# EAGLE design SRAM 4MB 2048kbx16 CPLD_Proto (EAGLE 6.4)
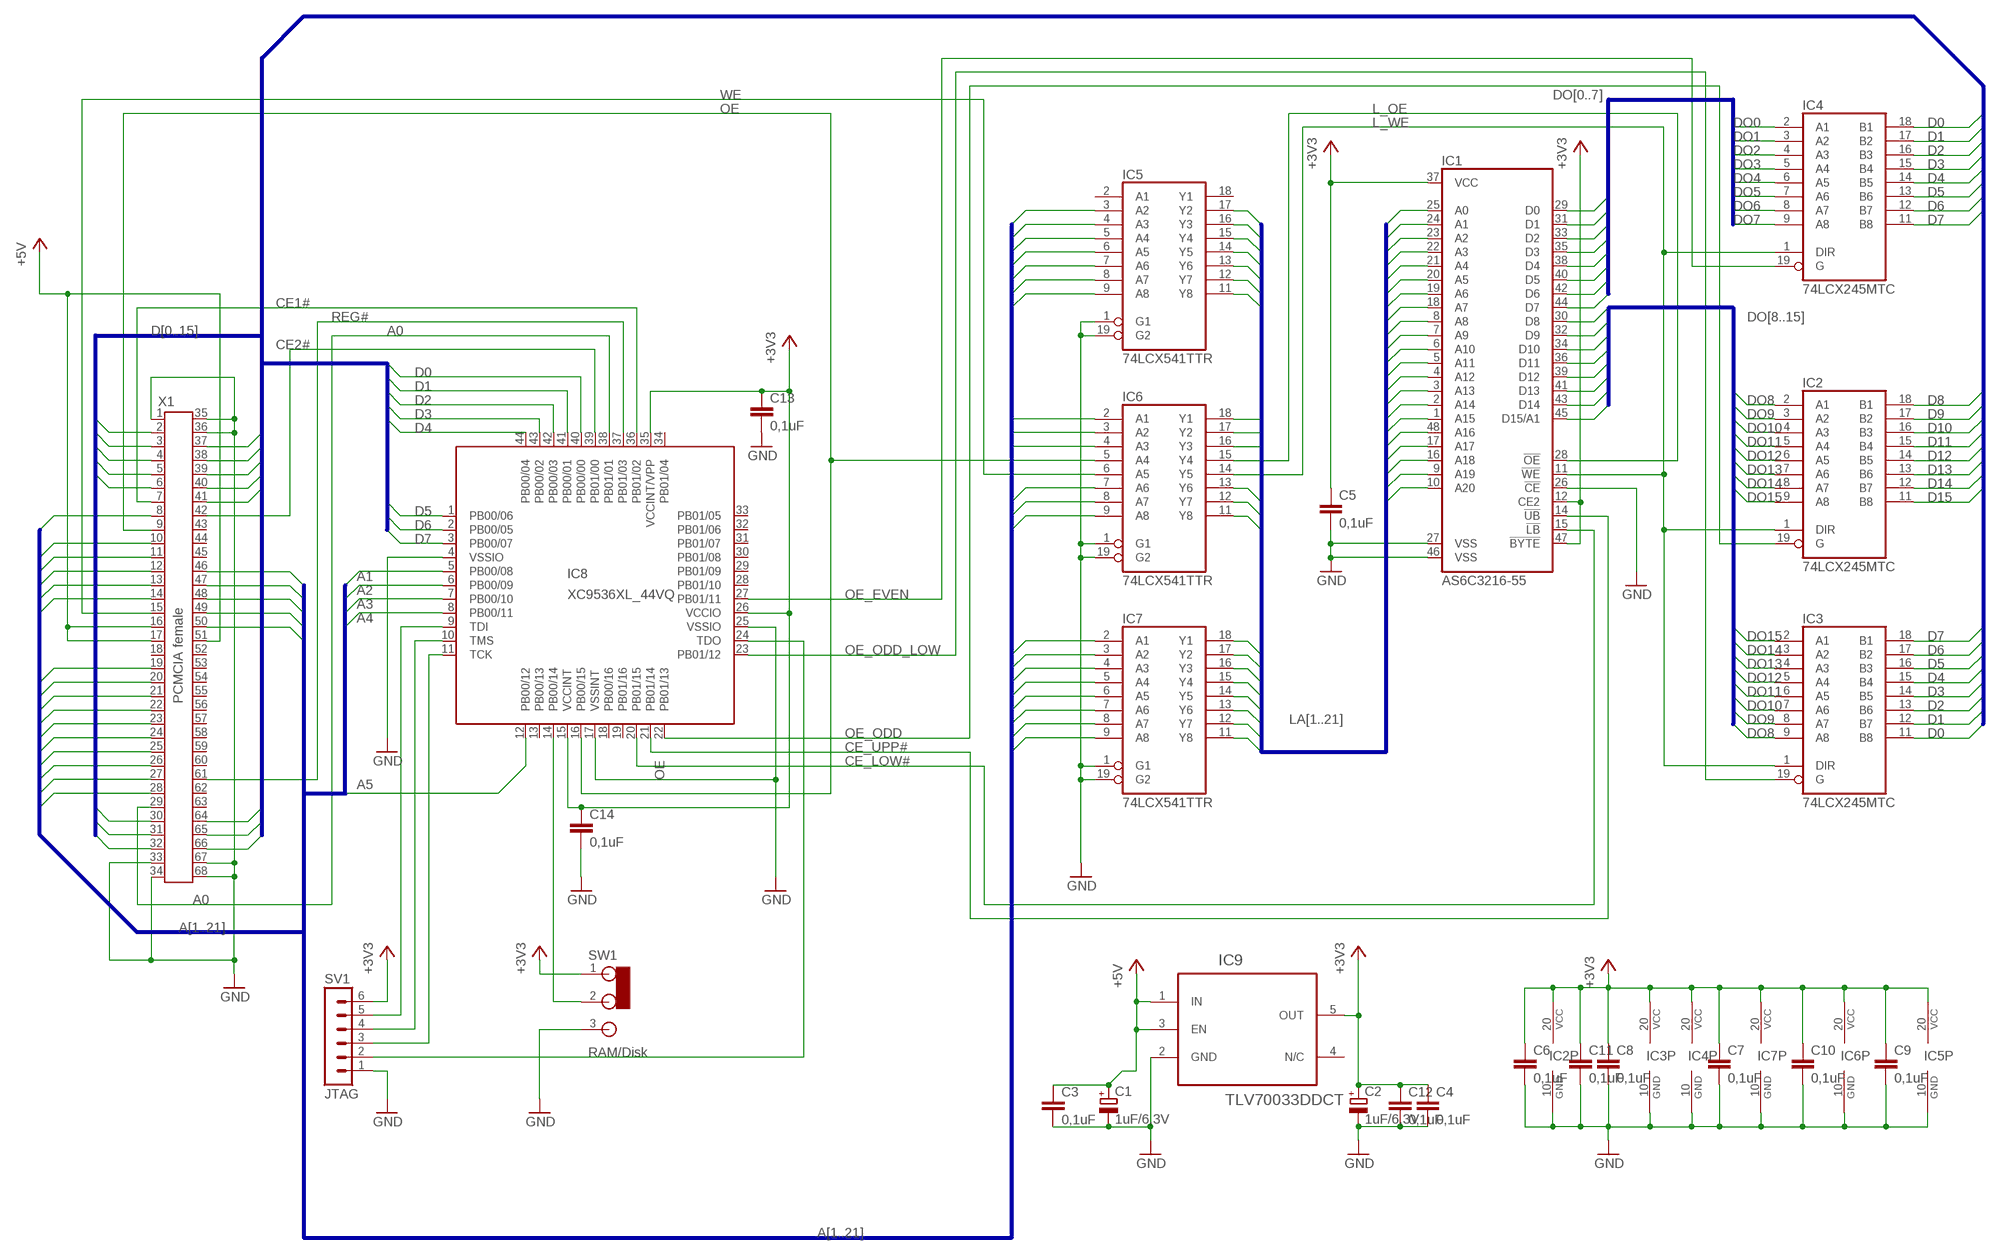
[diagram p0: schematic, sheet 1]

## Parts
C1  1uF/6,3V  CPOL-EUA/3216-18R  [A/3216-18R]
C2  1uF/6,3V  CPOL-EUA/3216-18R  [A/3216-18R]
C3  0,1uF  C-EUC0603  [C0603]
C4  0,1uF  C-EUC0603  [C0603]
C5  0,1uF  C-EUC0402K  [C0402K]
C6  0,1uF  C-EUC0402K  [C0402K]
C7  0,1uF  C-EUC0402K  [C0402K]
C8  0,1uF  C-EUC0402K  [C0402K]
C9  0,1uF  C-EUC0402K  [C0402K]
C10  0,1uF  C-EUC0402K  [C0402K]
C11  0,1uF  C-EUC0402K  [C0402K]
C12  0,1uF  C-EUC0402K  [C0402K]
C13  0,1uF  C-EUC0402K  [C0402K]
C14  0,1uF  C-EUC0402K  [C0402K]
IC1  AS6C3216-55  [TSOP-48]
IC2  74LCX245MTC  74LS245MTC  [TSSOP20]
IC3  74LCX245MTC  74LS245MTC  [TSSOP20]
IC4  74LCX245MTC  74LS245MTC  [TSSOP20]
IC5  74LCX541TTR  74541TTR  [TSSOP20]
IC6  74LCX541TTR  74541TTR  [TSSOP20]
IC7  74LCX541TTR  74541TTR  [TSSOP20]
IC8  XC9536XL_44VQ  XC9536_44VQ  [SQFP-S-10X10-44]
IC9  TLV70033DDCT  [SOT95P280X110-5N]
SV1  JTAG  MA06-1  [MA06-1]
SW1  RAM/Disk  AYZ0102AGRLC  [SWITCH2]
X1  PCMCIA female  9M681X03TB9M681Z04  [9M681X04]

## Nets
+3V3 [+3.3V]: C2.+ C4.1 C5.1 C6.1 C7.1 C8.1 C9.1 C10.1 C11.1 C12.1 C13.1 C14.1 IC1.12(CE2) IC1.37(VCC) IC1.47(!BYTE) IC2.20(VCC) IC3.20(VCC) IC4.20(VCC) IC5.20(VCC) IC6.20(VCC) IC7.20(VCC) IC8.15(VCCINT) IC8.26(VCCIO) IC8.35(VCCINT/VPP) IC9.5(OUT) SV1.6 SW1.1
+5V [+5V]: C1.+ C3.1 IC9.1(IN) IC9.3(EN) X1.16 X1.17 X1.51
A0: IC8.38(PB01/01) X1.29
A1: IC6.4(A3) IC8.5(PB00/08) X1.28
A2: IC5.3(A2) IC8.6(PB00/09) X1.27
A3: IC5.4(A3) IC8.7(PB00/10) X1.26
A4: IC5.5(A4) IC8.8(PB00/11) X1.25
A5: IC5.6(A5) IC8.12(PB00/12) X1.24
A6: IC5.7(A6) X1.23
A7: IC5.8(A7) X1.22
A8: IC5.9(A8) X1.12
A9: IC6.9(A8) X1.11
A10: IC7.9(A8) X1.8
A11: IC7.8(A7) X1.10
A12: IC7.7(A6) X1.21
A13: IC7.6(A5) X1.13
A14: IC7.5(A4) X1.14
A15: IC7.4(A3) X1.20
A16: IC7.3(A2) X1.19
A17: IC7.2(A1) X1.46
A18: IC6.2(A1) X1.47
A19: IC6.3(A2) X1.48
A20: IC6.8(A7) X1.49
A21: IC6.7(A6) X1.50
CE1#: IC8.36(PB01/02) X1.7
CE2#: IC8.39(PB01/00) X1.42
CE_LOW#: IC1.15(!LB) IC8.20(PB01/15)
CE_UPP#: IC1.14(!UB) IC8.21(PB01/14)
D0: IC3.11(B8) IC4.18(B1) IC8.40(PB00/00) X1.30
D1: IC3.12(B7) IC4.17(B2) IC8.41(PB00/01) X1.31
D2: IC3.13(B6) IC4.16(B3) IC8.42(PB00/03) X1.32
D3: IC3.14(B5) IC4.15(B4) IC8.43(PB00/02) X1.2
D4: IC3.15(B4) IC4.14(B5) IC8.44(PB00/04) X1.3
D5: IC3.16(B3) IC4.13(B6) IC8.1(PB00/06) X1.4
D6: IC3.17(B2) IC4.12(B7) IC8.2(PB00/05) X1.5
D7: IC3.18(B1) IC4.11(B8) IC8.3(PB00/07) X1.6
D8: IC2.18(B1) X1.64
D9: IC2.17(B2) X1.65
D10: IC2.16(B3) X1.66
D11: IC2.15(B4) X1.37
D12: IC2.14(B5) X1.38
D13: IC2.13(B6) X1.39
D14: IC2.12(B7) X1.40
D15: IC2.11(B8) X1.41
DO0: IC1.29(D0) IC4.2(A1)
DO1: IC1.31(D1) IC4.3(A2)
DO2: IC1.33(D2) IC4.4(A3)
DO3: IC1.35(D3) IC4.5(A4)
DO4: IC1.38(D4) IC4.6(A5)
DO5: IC1.40(D5) IC4.7(A6)
DO6: IC1.42(D6) IC4.8(A7)
DO7: IC1.44(D7) IC4.9(A8)
DO8: IC1.30(D8) IC2.2(A1) IC3.9(A8)
DO9: IC1.32(D9) IC2.3(A2) IC3.8(A7)
DO10: IC1.34(D10) IC2.4(A3) IC3.7(A6)
DO11: IC1.36(D11) IC2.5(A4) IC3.6(A5)
DO12: IC1.39(D12) IC2.6(A5) IC3.5(A4)
DO13: IC1.41(D13) IC2.7(A6) IC3.4(A3)
DO14: IC1.43(D14) IC2.8(A7) IC3.3(A2)
DO15: IC1.45(D15/A1) IC2.9(A8) IC3.2(A1)
GND [Ground]: C1.- C2.- C3.2 C4.2 C5.2 C6.2 C7.2 C8.2 C9.2 C10.2 C11.2 C12.2 C13.2 C14.2 IC1.26(!CE) IC1.27(VSS) IC1.46(VSS) IC2.10(GND) IC3.10(GND) IC4.10(GND) IC5.1(G1) IC5.10(GND) IC5.19(G2) IC6.1(G1) IC6.10(GND) IC6.19(G2) IC7.1(G1) IC7.10(GND) IC7.19(G2) IC8.4(VSSIO) IC8.17(VSSINT) IC8.25(VSSIO) IC9.2(GND) SV1.1 SW1.3 X1.1 X1.33 X1.34 X1.35 X1.36 X1.67 X1.68
L_OE: IC1.28(!OE) IC6.15(Y4)
L_WE: IC1.11(!WE) IC2.1(DIR) IC3.1(DIR) IC4.1(DIR) IC6.14(Y5)
LA1: IC1.25(A0) IC6.16(Y3)
LA2: IC1.24(A1) IC5.17(Y2)
LA3: IC1.23(A2) IC5.16(Y3)
LA4: IC1.22(A3) IC5.15(Y4)
LA5: IC1.21(A4) IC5.14(Y5)
LA6: IC1.20(A5) IC5.13(Y6)
LA7: IC1.19(A6) IC5.12(Y7)
LA8: IC1.18(A7) IC5.11(Y8)
LA9: IC1.8(A8) IC6.11(Y8)
LA10: IC1.7(A9) IC7.11(Y8)
LA11: IC1.6(A10) IC7.12(Y7)
LA12: IC1.5(A11) IC7.13(Y6)
LA13: IC1.4(A12) IC7.14(Y5)
LA14: IC1.3(A13) IC7.15(Y4)
LA15: IC1.2(A14) IC7.16(Y3)
LA16: IC1.1(A15) IC7.17(Y2)
LA17: IC1.48(A16) IC7.18(Y1)
LA18: IC1.17(A17) IC6.18(Y1)
LA19: IC1.16(A18) IC6.17(Y2)
LA20: IC1.9(A19) IC6.12(Y7)
LA21: IC1.10(A20) IC6.13(Y6)
N$1: IC8.24(TDO) SV1.2
N$2: IC8.11(TCK) SV1.3
N$3: IC8.10(TMS) SV1.4
N$4: IC8.9(TDI) SV1.5
N$8: IC8.14(PB00/14) SW1.2
OE: IC6.5(A4) IC8.16(PB00/15) X1.9
OE_EVEN: IC4.19(G) IC8.27(PB01/11)
OE_ODD: IC2.19(G) IC8.22(PB01/13)
OE_ODD_LOW: IC3.19(G) IC8.23(PB01/12)
REG#: IC8.37(PB01/03) X1.61
WE: IC6.6(A5) X1.15
Unconnected: IC5.2(A1) IC5.18(Y1) IC8.13(PB00/13) IC8.18(PB00/16) IC8.19(PB01/16) IC8.28(PB01/10) IC8.29(PB01/09) IC8.30(PB01/08) IC8.31(PB01/07) IC8.32(PB01/06) IC8.33(PB01/05) IC8.34(PB01/04) IC9.4(N/C) X1.18 X1.43 X1.44 X1.45 X1.52 X1.53 X1.54 X1.55 X1.56 X1.57 X1.58 X1.59 X1.60 X1.62 X1.63

## Buses
DO[8..15]
DO[0..7]
D[0..15]
A[1..21]
LA[1..21]

## Library data of the parts
C1 C2 = resistor:CPOL-EU: POLARIZED CAPACITOR, European symbol
C3-C14 = resistor:C-EU: CAPACITOR, European symbol
IC1 = Alliance_Memory_By_element14_Batch_1:AS6C3216-55: SRAM memory 32Mb (2MB x 16 lub 4MB x 8)
IC2-IC4 = 74xx-us:74*245: Octal BUS TRANSCEIVER, 3-state
IC5-IC7 = 74xx-us:74*541: Octal BUFFER and LINE DRIVER, 3-state
IC8 = xilinx-xc9:XC9536_44VQ: xc9536_pc44 XC9500 In-System Programmable CPLD Family Auto generated by make-symbol-device-package-bsdl.ulp Rev. 34 Source: xc9536_vq44.bsd; MPN: XC9536-15VQG44C; OC_FARNELL: 1193227; OC_NEWARK: 98K3377
IC9 = _V-reg33V:TLV70033DDCT: 200-mA, Low-IQ, Low-Dropout Regulator for Portable Devices; MPN: TLV70033DDCT; OC_FARNELL: 1778230; OC_NEWARK: 50R4446; PACKAGE: TSOT-23-5; SUPPLIER: Texas Instruments
SV1 = con-lstb:MA06-1: PIN HEADER; OC_FARNELL: unknown; OC_NEWARK: unknown
SW1 = amiga:AYZ0102AGRLC: SWITCH
X1 = 3M:9M681X03TB

## Net classes
0 default: width 0.102 mm
1 Ground: width 0.254 mm
2 +5V: width 0.254 mm
3 +3.3V: width 0.254 mm

## Board
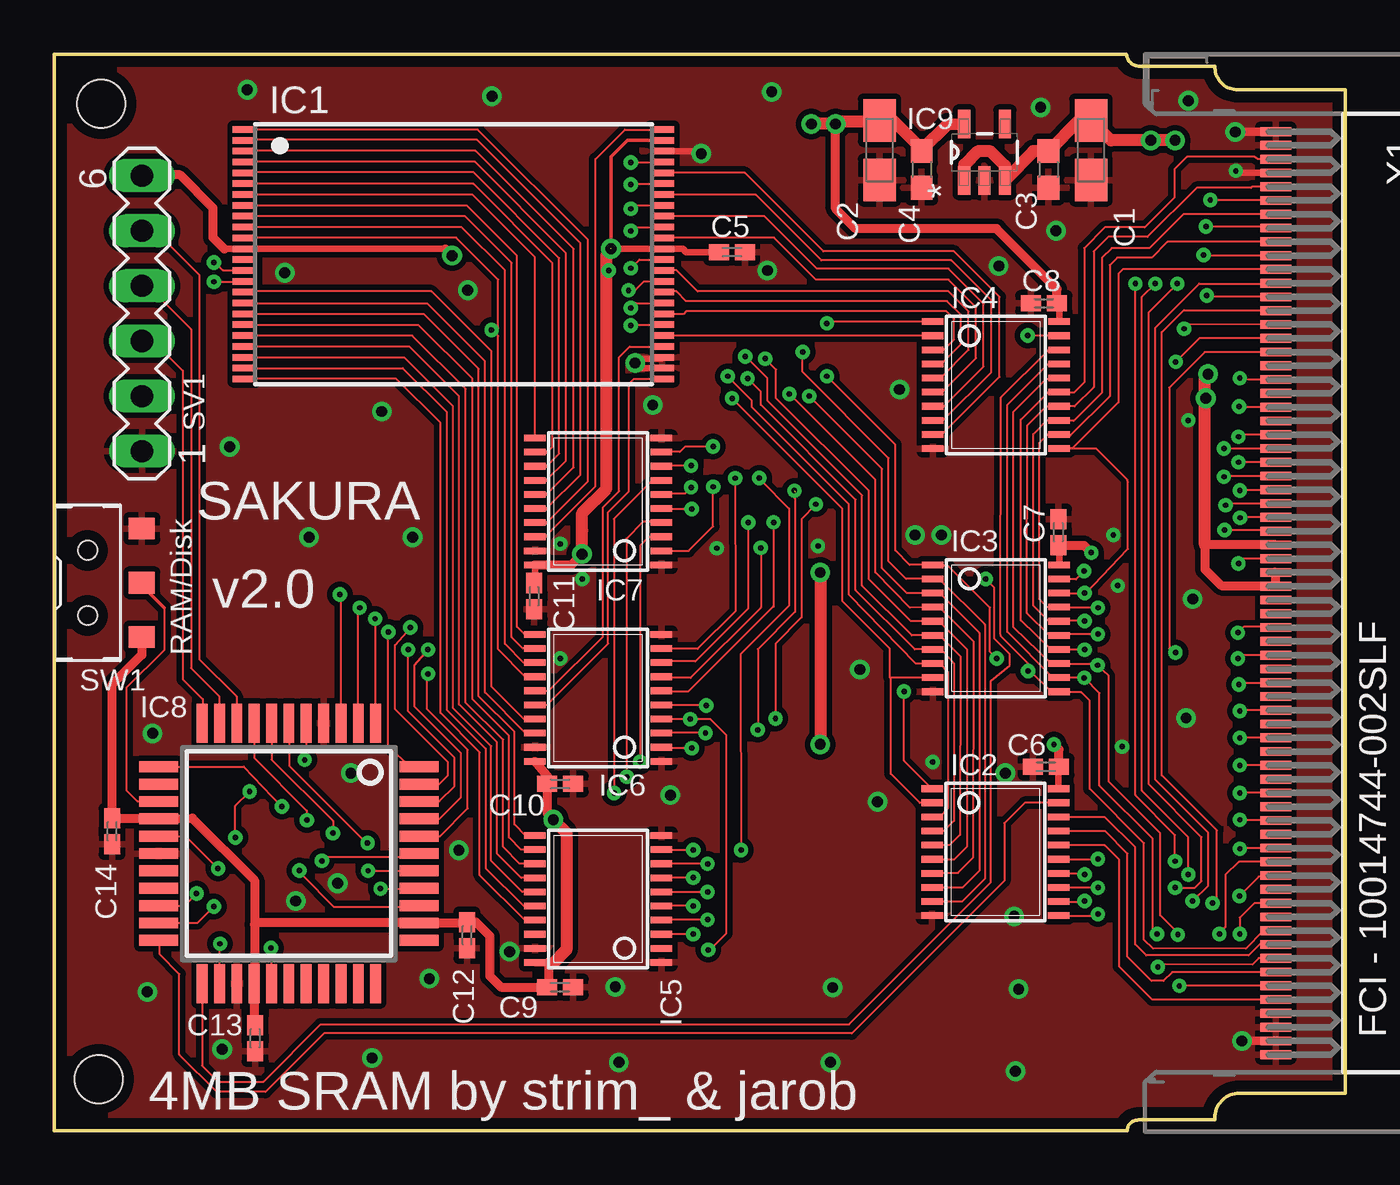
[diagram p1: board, top side]
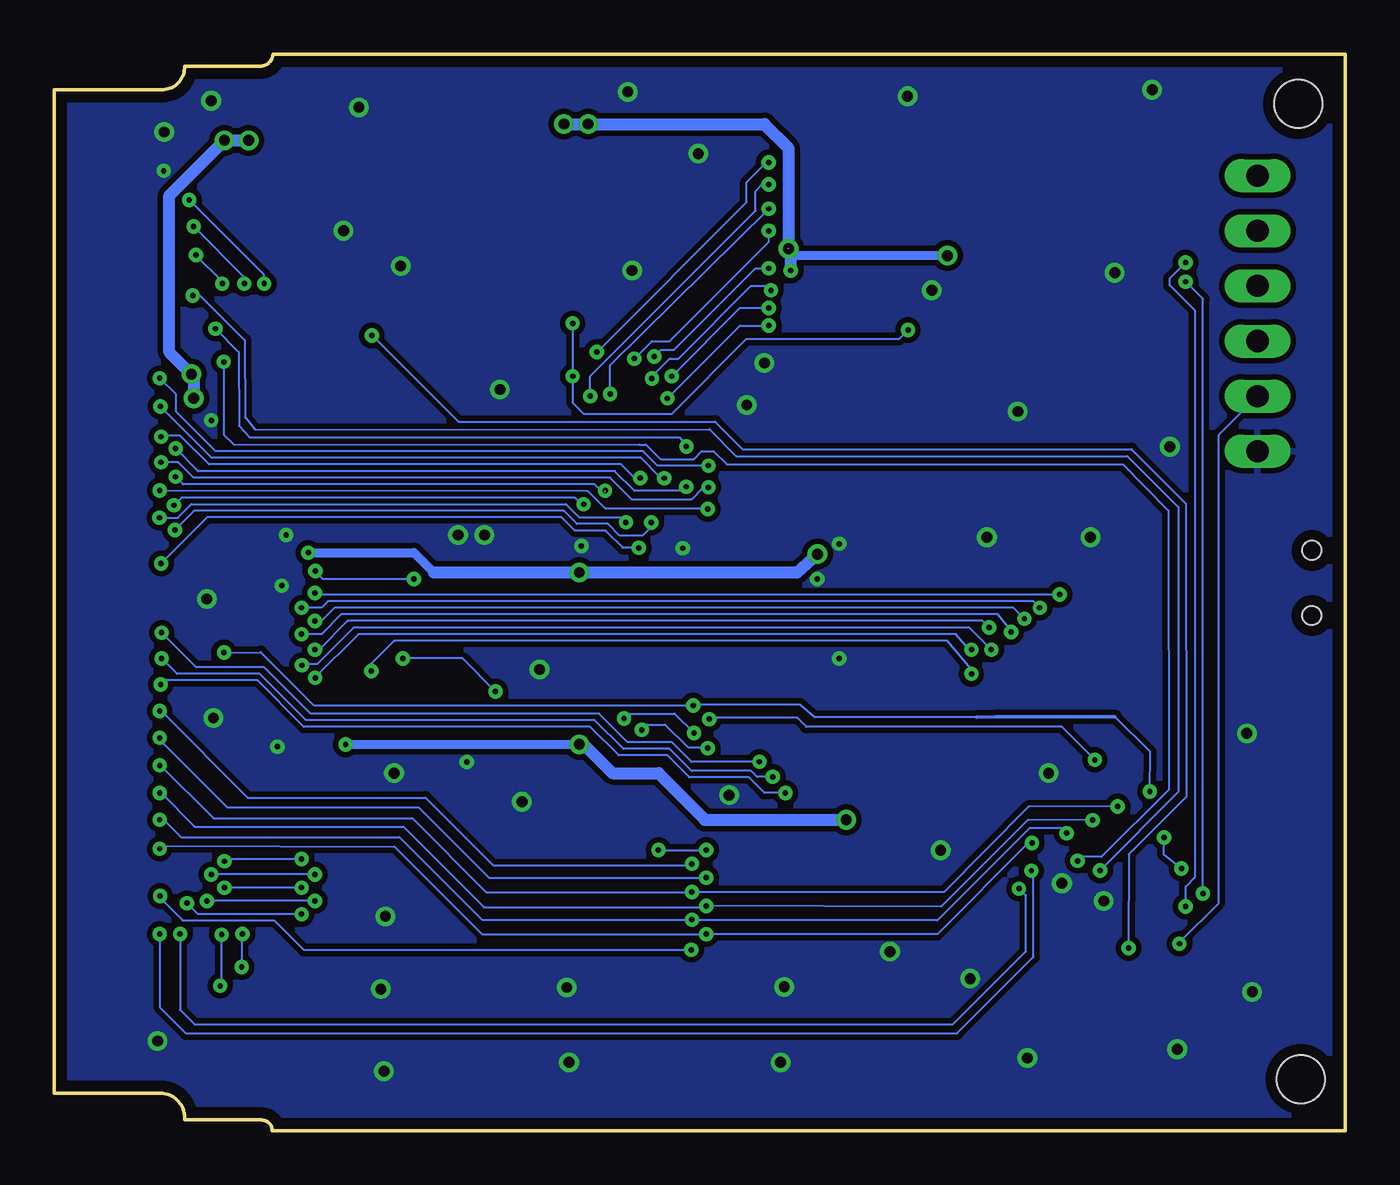
[diagram p2: board, bottom side, seen from below]

Size 59.53 x 49.61 mm. Coordinates in mm from the lower left corner, seen from the top.
Outline: 0,0 49.47,0 arc-90 49.98,0.49 53.52,0.49 arc-90 54.53,1.71 59.53,1.71 59.53,47.98 54.47,47.98 arc-90 53.52,49.06 50.08,49.06 arc-90 49.44,49.6 0,49.61 0,0
Copper layers (1*16): Top 0.035mm / dielectric 1.5mm / Bottom 0.035mm
Design rules "default *": minimum track width 0.015mm, minimum drill 0.25mm, track to track 4mil, track to pad 6mil, pad to pad 6mil, via to via 6mil, smd to smd 6mil, copper to edge 20mil, drill to drill 8mil, minimum pad ring 10mil, minimum via ring 8mil, stop-mask expansion 4mil, vias tented up to drill 20mil, thermal gap 10mil
Holes 2.2 mm at 2.05,2.37 2.17,47.33

### Footprints (pad centres in the part's own frame; a part is rotated, then mirrored left to right if it is on the bottom)
A/3216-18R = smd 1.95 x 1.5: + 1.375,0; - -1.375,0
C0603 = smd 1.1 x 1: 1 -0.85,0; 2 0.85,0
C0402K = smd 0.925 x 0.74: 1 -0.6,0; 2 0.6,0
TSOP-48 = smd 1.1 x 0.3: 1 -9.625,5.75; 2 -9.625,5.25; 3 -9.625,4.75; 4 -9.625,4.25; 5 -9.625,3.75; 6 -9.625,3.25; 7 -9.625,2.75; 8 -9.625,2.25; 9 -9.625,1.75; 10 -9.625,1.25; 11 -9.625,0.75; 12 -9.625,0.25; 13 -9.625,-0.25; 14 -9.625,-0.75; 15 -9.625,-1.25; 16 -9.625,-1.75; 17 -9.625,-2.25; 18 -9.625,-2.75; 19 -9.625,-3.25; 20 -9.625,-3.75; 21 -9.625,-4.25; 22 -9.625,-4.75; 23 -9.625,-5.25; 24 -9.625,-5.75; 25 9.625,-5.75; 26 9.625,-5.25; 27 9.625,-4.75; 28 9.625,-4.25; 29 9.625,-3.75; 30 9.625,-3.25; 31 9.625,-2.75; 32 9.625,-2.25; 33 9.625,-1.75; 34 9.625,-1.25; 35 9.625,-0.75; 36 9.625,-0.25; 37 9.625,0.25; 38 9.625,0.75; 39 9.625,1.25; 40 9.625,1.75; 41 9.625,2.25; 42 9.625,2.75; 43 9.625,3.25; 44 9.625,3.75; 45 9.625,4.25; 46 9.625,4.75; 47 9.625,5.25; 48 9.625,5.75
TSSOP20 = smd 0.305 x 0.991: 1 -2.925,-2.918; 2 -2.275,-2.918; 3 -1.625,-2.918; 4 -0.975,-2.918; 5 -0.325,-2.918; 6 0.325,-2.918; 7 0.975,-2.918; 8 1.625,-2.918; 9 2.275,-2.918; 10 2.925,-2.918; 11 2.925,2.918; 12 2.275,2.918; 13 1.625,2.918; 14 0.975,2.918; 15 0.325,2.918; 16 -0.325,2.918; 17 -0.975,2.918; 18 -1.625,2.918; 19 -2.275,2.918; 20 -2.925,2.918
SQFP-S-10X10-44 = smd 0.5 x 1.8: 1 -4,-6; 2 -3.2,-6; 3 -2.4,-6; 4 -1.6,-6; 5 -0.8,-6; 6 0,-6; 7 0.8,-6; 8 1.6,-6; 9 2.4,-6; 10 3.2,-6; 11 4,-6; 23 4,6; 24 3.2,6; 25 2.4,6; 26 1.6,6; 27 0.8,6; 28 0,6; 29 -0.8,6; 30 -1.6,6; 31 -2.4,6; 32 -3.2,6; 33 -4,6 | smd 1.8 x 0.5: 12 6,-4; 13 6,-3.2; 14 6,-2.4; 15 6,-1.6; 16 6,-0.8; 17 6,0; 18 6,0.8; 19 6,1.6; 20 6,2.4; 21 6,3.2; 22 6,4; 34 -6,4; 35 -6,3.2; 36 -6,2.4; 37 -6,1.6; 38 -6,0.8; 39 -6,0; 40 -6,-0.8; 41 -6,-1.6; 42 -6,-2.4; 43 -6,-3.2; 44 -6,-4
SOT95P280X110-5N = smd 1.321 x 0.559: 1 -1.295,0.94; 2 -1.295,0; 3 -1.295,-0.94; 4 1.295,-0.94; 5 1.295,0.94
MA06-1 = drill 1.016 long: 1 -6.35,0; 2 -3.81,0; 3 -1.27,0; 4 1.27,0; 5 3.81,0; 6 6.35,0
SWITCH2 = smd 1 x 1.2: 1 -2.5,1; 2 0,1; 3 2.5,1 | hole 0.85: -1.5,3.5; 1.5,3.5
9M681X04 = smd 0.406 x 1.422: 1 -20.955,-3.175; 2 -19.685,-3.175; 3 -18.415,-3.175; 4 -17.145,-3.175; 5 -15.875,-3.175; 6 -14.605,-3.175; 7 -13.335,-3.175; 8 -12.065,-3.175; 9 -10.795,-3.175; 10 -9.525,-3.175; 11 -8.255,-3.175; 12 -6.985,-3.175; 13 -5.715,-3.175; 14 -4.445,-3.175; 15 -3.175,-3.175; 16 -1.905,-3.175; 17 -0.635,-3.175; 18 0.635,-3.175; 19 1.905,-3.175; 20 3.175,-3.175; 21 4.445,-3.175; 22 5.715,-3.175; 23 6.985,-3.175; 24 8.255,-3.175; 25 9.525,-3.175; 26 10.795,-3.175; 27 12.065,-3.175; 28 13.335,-3.175; 29 14.605,-3.175; 30 15.875,-3.175; 31 17.145,-3.175; 32 18.415,-3.175; 33 19.685,-3.175; 34 20.955,-3.175; 35 -20.32,-3.175; 36 -19.05,-3.175; 37 -17.78,-3.175; 38 -16.51,-3.175; 39 -15.24,-3.175; 40 -13.97,-3.175; 41 -12.7,-3.175; 42 -11.43,-3.175; 43 -10.16,-3.175; 44 -8.89,-3.175; 45 -7.62,-3.175; 46 -6.35,-3.175; 47 -5.08,-3.175; 48 -3.81,-3.175; 49 -2.54,-3.175; 50 -1.27,-3.175; 51 0,-3.175; 52 1.27,-3.175; 53 2.54,-3.175; 54 3.81,-3.175; 55 5.08,-3.175; 56 6.35,-3.175; 57 7.62,-3.175; 58 8.89,-3.175; 59 10.16,-3.175; 60 11.43,-3.175; 61 12.7,-3.175; 62 13.97,-3.175; 63 15.24,-3.175; 64 16.51,-3.175; 65 17.78,-3.175; 66 19.05,-3.175; 67 20.32,-3.175; 68 21.59,-3.175

### Placement (x,y rotation side)
C1  47.8,45.19 90 top
C2  38.06,45.19 90 top
C3  45.83,44.3 270 top
C4  39.99,44.3 270 top
C5  31.24,40.49 0 top
C6  45.73,16.77 180 top
C7  46.3,27.58 90 top
C8  45.63,38.13 180 top
C9  23.33,6.61 0 top
C10  23.33,15.98 0 top
C11  22.13,24.64 270 top
C12  19.03,9 270 top
C13  9.26,4.25 270 top
C14  2.67,13.79 270 top
IC1  18.41,40.39 0 top
IC2  43.39,12.83 270 top
IC3  43.42,23.15 270 top
IC4  43.42,34.36 270 top
IC5  25.08,10.67 90 top
IC6  25.08,19.95 90 top
IC7  25.08,28.99 90 top
IC8  10.82,12.77 180 top
IC9  42.89,45.09 90 top
SV1  4.04,37.66 90 top
SW1  5.04,25.25 90 top
X1  59.5,25.09 270 top

### Tracks (layer width: path | path; a pad name or v marks a point on that pad's centre or on a via)
+3V3  (via drill 0.25, 0.5)  (1 unrouted)
  Top 0.15: IC1.47 26.43,45.64 25.67,44.89 v25.67,40.65
  Top 0.305: 7.84,40.64 IC1.12 18.03,40.64 | 4.08,44.04 SV1.6 | C5.1 29.14,40.49 28.98,40.65 v25.67,40.65 26.39,40.64 IC1.37 | 4.8,14.39 IC8.15 | IC8.26 | 9.3,9.57 9.23,9.5 | 19,9.57 C12.1 19.45,9.6 | IC5.20 | IC5.20 22.8,7.76 | 9.22,4.59 C13.1 | C14.1 | C11.1 22.19,25.22 IC7.20 | IC5.20 22.19,7.72 23.01,7.72 | IC4.20 46.34,38.02 C8.1 | IC3.20 46.34,26.94 C7.1 | IC2.20 46.31,16.75 C6.1
  Top 0.406: 40.01,45.2 40.01,45.13 C4.1 40.18,45.05 | 38.06,46.5 C2.+ | 7.84,40.64 7.33,41.15 7.33,42.52 5.8,44.04 4.08,44.04 | 18.03,40.64 v18.35,40.33 | C14.1 4.8,14.39 | IC8.15 6.36,14.4 9.23,11.53 9.23,9.5 IC8.26 | 9.3,9.57 IC8.35 19,9.57 | 22.8,7.76 22.82,7.74 22.8,7.72 22.8,6.64 22.77,6.61 C9.1 20.6,6.61 20.08,7.13 20.08,8.97 19.45,9.6 | IC8.26 9.22,4.59 | SW1.1 4.04,21.93 2.66,20.55 C14.1 | IC6.20 22.73,16.35 C10.1 22.73,14.61 v23.01,14.33 | 36.13,46.5 v36.02,46.39 v36.03,46.39 36.03,46.35 | C8.1 46.23,38.79 43.45,41.57 36.94,41.57 36.03,42.49 36.03,46.35 | IC7.20 23.84,26.07 v24.33,26.57 | 25.46,40.33 v25.67,40.65 | C7.1 47.48,26.98 v47.82,26.64 | C6.1 46.33,17.56 v46.09,17.8 | 36.03,46.35 35.98,46.4 | v34.91,46.4 v34.91,46.39
  Top 0.559: IC9.5 41.18,46.37 40.01,45.2 | 40.18,45.05 38.74,46.5 38.06,46.5 36.13,46.5 | v23.01,14.33 23.62,13.72 23.62,8.32 23.01,7.72 | 25.46,40.33 25.46,29.58 24.35,28.47 24.35,27.65 v24.33,26.57 | v35.32,25.72 v35.32,17.8 | 35.98,46.4 v34.91,46.4
  Bottom 0.406: v18.35,40.33 25.25,40.33 v25.67,40.65 | v47.82,26.64 42.94,26.64 42.02,25.72 | v46.09,17.8 v35.32,17.8 35.12,17.8 | 25.57,40.56 25.67,40.66
  Bottom 0.559: v36.02,46.39 26.77,46.39 25.67,45.29 v25.67,40.65 | 42.02,25.72 v35.32,25.72 25.26,25.72 v24.33,26.57 | 35.12,17.8 33.8,16.48 31.66,16.48 29.52,14.33 23.02,14.33 v23.01,14.33 | v25.57,39.64 25.57,40.56
+5V  (via drill 0.5)
  Top 0.406: 56.22,25.72 X1.17 X1.51 56.3,25.11 53.81,25.11 53.06,25.86 53.06,26.99 X1.16 | C1.+ 47.24,46.56 | 53.06,34.73 v53.2,34.87
  Top 0.559: 47.24,46.56 C3.1 45.14,45.15 IC9.3 43.83,44.48 43.17,45.14 42.56,45.14 41.95,44.53 IC9.1 | 53.06,26.99 53.06,34.73 | v51.68,45.64 48.73,45.64 C1.+
  Bottom 0.406: v53.2,34.87 53.1,34.77
  Bottom 0.559: v53.2,34.87 54.22,35.88 54.22,43.1 v51.68,45.64 v50.56,45.64 | 53.1,34.77 v53.1,33.75
A0  (via drill 0.25)
  Top 0.102: X1.29 55.33,10.48 54.66,9.81 v54.66,9.06 | v14.47,11.98 IC8.38
  Top 0.15: IC8.38
  Bottom 0.102: v54.66,9.06 54.66,5.69 53.45,4.48 17.9,4.48 14.38,8.01 14.38,11.88
  Bottom 0.15: 14.38,11.88 v14.47,11.98
A1  (via drill 0.25)
  Top 0.102: X1.28 55.54,11.7 v54.64,10.81 | v30.16,8.33 30.26,8.36 30.99,9.09 30.99,18.22 30.25,18.96 v29.32,18.96 28,18.96 | IC8.5 11.62,17.16 v11.54,17.09
  Top 0.15: 28,18.96 IC6.4
  Bottom 0.102: v54.64,10.81 54.64,10.73 53.61,9.69 49.39,9.69 48.03,8.32 30.76,8.32 v30.16,8.33 | v11.54,17.09 13.07,18.61 24.85,18.61 25.26,19.02 28.96,19.02 v29.32,18.96
A2  (via drill 0.25)
  Top 0.102: X1.27 54.69,13.02 v54.66,12.99 | v29.46,9.05 IC5.3 | IC8.6 10.83,16.82 14.37,13.28 v14.45,13.25
  Top 0.15: IC5.3
  Bottom 0.102: v54.66,12.99 54.55,12.99 54.42,13.13 43.84,13.09 39.8,9.05 v29.46,9.05 18.81,9.05 14.6,13.3 14.49,13.3 v14.45,13.25
A3  (via drill 0.25)
  Top 0.102: X1.26 54.69,14.29 v54.66,14.33 | v30.12,9.72 28.02,9.72 | IC8.7 10.02,17.1 12.85,14.27 v12.85,13.71
  Top 0.15: 28.02,9.72 IC5.4
  Bottom 0.102: v54.66,14.33 54.47,14.33 53.68,13.53 43.61,13.53 39.8,9.72 v30.12,9.72 | v12.85,13.71 13.08,13.94 14.49,13.94 14.54,13.95 18.81,9.69 30.09,9.69
  Bottom 0.15: 30.09,9.69 v30.12,9.72
A4  (via drill 0.25)
  Top 0.102: X1.25 v54.66,15.56 | v29.46,10.36 IC5.5 | IC8.8 9.22,17.19 11.65,14.75 v11.65,14.31
  Top 0.15: IC5.5
  Bottom 0.102: v54.66,15.56 54.6,15.56 53.04,14.01 43.42,14.01 39.71,10.29 29.52,10.29 v29.46,10.36 18.64,10.32 14.63,14.32 v11.65,14.31
A5  (via drill 0.25)
  Top 0.102: X1.24 v54.66,16.83 | v30.12,10.99 IC5.6 | IC8.12 8.74,16.77 v10.5,14.93
  Top 0.15: IC5.6
  Bottom 0.102: v54.66,16.83 54.63,16.83 52.18,14.39 43.01,14.39 39.61,10.99 v30.12,10.99 18.5,10.99 14.59,14.94 v10.5,14.93
A6  (via drill 0.25)
  Top 0.102: X1.23 v54.66,18.1 | v29.46,11.66 IC5.7
  Top 0.15: IC5.7
  Bottom 0.102: v54.66,18.1 54.66,18.01 51.55,14.9 42.72,14.9 39.48,11.66 v29.46,11.66
A7  (via drill 0.25)
  Top 0.102: X1.22 54.69,19.37 v54.66,19.34 | v30.12,12.29 IC5.8
  Top 0.15: IC5.8
  Bottom 0.102: v54.66,19.34 54.6,19.34 50.6,15.34 42.41,15.34 39.29,12.23 30.19,12.23
  Bottom 0.15: 30.19,12.23 v30.12,12.29
A8  (via drill 0.25)
  Top 0.102: X1.12 54.69,32.07 v54.6,31.98 | v32.51,30.08 32.61,29.96 33.88,28.66 33.88,24.19 31.65,21.96 v31.67,12.93 | v29.46,12.93 28.02,12.93
  Top 0.15: 28.02,12.93 IC5.9
  Bottom 0.102: v31.67,12.93 v29.46,12.93 | v32.51,30.08 32.87,30.18 33.39,30.7 52.39,30.7 53.71,32.02 54.55,32.02 v54.6,31.98
A9  (via drill 0.25)
  Top 0.102: X1.11 54.66,33.34 v54.63,33.38 | v31.39,30.07 31.41,23.93 29.67,22.2 28.02,22.2
  Top 0.15: 28.02,22.2 IC6.9
  Bottom 0.102: v31.39,30.07 31.64,30.17 32.47,31.01 52.26,31.01 v54.63,33.38
A10  (via drill 0.25)
  Top 0.102: X1.8 52.25,37.15 v52.09,36.96 | v30.38,31.53 29.09,31.53 28.84,31.28 IC7.9
  Top 0.15: IC7.9
  Bottom 0.102: v52.09,36.96 51.02,35.88 51,32.48 50.52,31.95 30.7,31.95 v30.38,31.53
A11  (via drill 0.25)
  Top 0.102: X1.10 55.07,34.61 v54.66,34.68 | v29.36,30.64 28.02,30.64
  Top 0.15: 28.02,30.64 IC7.8
  Bottom 0.102: v29.36,30.64 31.71,30.64 32.37,31.31 52.08,31.31 53.91,33.14 53.91,33.93 v54.66,34.68
A12  (via drill 0.25)
  Top 0.102: IC7.7 27.58,29.97 27.39,29.79 25.81,28.19 v25.81,15.56 | v54.62,20.56 54.55,20.46 54.46,20.64 X1.21
  Bottom 0.102: v25.81,15.56 26.78,15.56 27.5,16.27 30.24,16.27 31.26,17.29 33.49,17.29 34.81,18.61 48.02,18.61 50.15,20.75 54.43,20.75 v54.62,20.56
A13  (via drill 0.25)
  Top 0.102: X1.13 v54.6,30.8 | v29.36,29.65 v29.36,29.64 29.08,29.36 28.02,29.34
  Top 0.15: 28.02,29.34 IC7.6
  Bottom 0.102: v29.36,29.65 29.59,29.65 30.14,29.08 32.88,29.08 33.9,30.09 53.1,30.09 53.81,30.8 v54.6,30.8
A14  (via drill 0.25)
  Top 0.102: X1.14 56.06,29.5 v54.66,29.5 | v29.39,28.64 28.02,28.64
  Top 0.15: 28.02,28.64 IC7.5
  Bottom 0.102: v54.66,29.5 34.93,29.49 34.12,28.69 29.43,28.69 29.48,28.64 v29.39,28.64
A15  (via drill 0.25)
  Top 0.102: IC7.4 28,28.06 27.15,28.06 26.38,27.29 v26.4,16.31 | X1.20 54.72,21.91 v54.57,21.76
  Bottom 0.102: v26.4,16.31 27.12,16.31 27.39,16.58 30.14,16.58 31.15,17.6 33.29,17.6 34.61,18.92 47.92,18.92 50.05,21.05 53.86,21.05 v54.57,21.76
A16  (via drill 0.25)
  Top 0.102: IC7.3 28.11,27.35 27.41,27.35 27.02,26.96 v27.01,17 | X1.19 56.29,23.22 54.84,23.22 v54.57,22.95
  Bottom 0.102: v27.01,17 30.15,17 31.05,17.9 33.08,17.9 34.4,19.22 47.71,19.22 49.85,21.35 52.98,21.35 v54.57,22.95
A17  (via drill 0.25)
  Top 0.102: IC7.2 29.25,26.72 30.39,27.85 v30.39,29.67 | v53.93,31.44 X1.46
  Bottom 0.102: v30.39,29.67 30.34,29.69 30.54,29.48 32.78,29.48 33.68,30.38 33.66,30.38 52.89,30.38 v53.93,31.44
A18  (via drill 0.25)  (1 unrouted)
  Top 0.102: X1.47 53.96,30.17 v53.93,30.14 | v34.13,29.5 34.15,29.13 34.16,23.91 32.44,22.19 v32.44,18.47 | v29.39,17.63 28.04,17.63
  Top 0.15: 28.04,17.63 IC6.2
  Bottom 0.102: v32.44,18.47 32.47,18.41 32.17,18.71 31.36,18.71 30.3,17.66 29.43,17.66 v29.39,17.63 | 34.16,29.43 34.26,29.43 34.61,29.79 53.58,29.79 v53.93,30.14
A19  (via drill 0.25)
  Top 0.102: v35.12,28.87 34.46,28.17 34.46,23.65 33.26,22.45 v33.26,19 | v30.03,18.33 IC6.3 | X1.48 54.08,28.9 v54.01,28.82
  Top 0.15: IC6.3
  Bottom 0.102: 53.7,28.8 v54.01,28.82 53.65,29.18 35.52,29.18 35.23,28.89 v35.12,28.87 | v33.26,19 33.08,19.22 30.92,19.22 v30.03,18.33
A20  (via drill 0.25)
  Top 0.102: 55.74,27.63 X1.49 56.32,27.69 v53.96,27.69 | v32,28.03 31.99,24.05 29.57,21.63 28.05,21.63
  Top 0.15: 28.05,21.63 IC6.8
  Bottom 0.102: v32,28.03 32,27.83 32.4,27.42 33.46,27.42 34,27.96 35.42,27.96 36.03,28.57 53.07,28.57 v53.96,27.69
A21  (via drill 0.25)
  Top 0.102: v32.58,26.86 32.58,24.1 29.34,20.87 28.05,20.87 | X1.50 54.81,26.36 v54.6,26.14
  Top 0.15: 28.05,20.87 IC6.7
  Bottom 0.102: v32.58,26.86 33.31,26.86 34.1,27.65 35.52,27.65 36.13,28.26 52.48,28.26 v54.6,26.14
CE1#  (via drill 0.25)
  Top 0.102: X1.7 53.4,38.42 v53.14,38.49 | v11.3,11.99 11.45,11.77 12.88,10.32 16.78,10.32
  Top 0.15: 16.78,10.32 IC8.36
  Bottom 0.102: v53.14,38.49 52.8,38.49 50.74,36.43 50.73,32.87 50.27,32.31 29.32,32.33 28.09,31.09 10.06,31.09 7.69,28.72 7.7,15.63 v11.3,11.99
CE2#  (via drill 0.25)
  Top 0.102: v12.34,12.43 12.46,12.62 16.67,12.62 16.79,12.74 | X1.42 52.79,36.52 v51.71,35.43
  Top 0.15: 16.79,12.74 IC8.39
  Bottom 0.102: v51.71,35.43 51.7,32.08 51.25,31.63 32.56,31.62 32.25,31.62 31.58,30.95 30.03,30.95 29.68,31.31 29.12,31.31 28.51,30.7 10.25,30.7 8.15,28.57 8.13,15.72 11.24,12.62 12.16,12.62 v12.34,12.43
CE_LOW#  (via drill 0.25)
  Top 0.102: IC8.20 6.01,10.37 v6.57,10.93 | v7.36,39.12 8.67,39.12
  Top 0.15: 8.67,39.12 IC1.15
  Bottom 0.102: v6.57,10.93 6.57,38.33 v7.36,39.12
CE_UPP#  (via drill 0.25)
  Top 0.102: IC8.21 6.6,9.57 v7.36,10.32 | v7.36,40.01 7.42,40.01 7.77,39.66 8.76,39.66
  Top 0.15: 8.76,39.66 IC1.14
  Bottom 0.102: v7.36,10.32 7.36,11.25 6.92,11.69 6.92,37.78 8.09,38.95 8.09,39.28 v7.36,40.01
D0  (via drill 0.25)
  Top 0.102: IC4.18 46.3,35.95 45.8,35.95 43.65,33.79 43.62,22.94 43.65,22.78 44.9,21.52 v44.9,21.19 45.06,21.14 45.97,20.23 IC3.11 46.37,20.2 47.35,20.2 47.75,19.81 47.75,15.75 50.25,13.25 50.25,8.79 50.66,8.4 54.93,8.39 55.75,9.21 X1.30 | IC8.40 17.78,13.57 19.06,14.85 19.06,17.55 17.2,19.42 17.2,21.01 v17.23,21.05
  Bottom 0.102: v17.23,21.05 17.23,21.25 18.35,22.57 43.85,22.57 44.9,21.52 v44.9,21.19
D1  (via drill 0.25)
  Top 0.102: IC4.17 46.32,35.31 45.8,35.31 43.94,33.45 43.94,22.99 46.05,20.88 IC3.12 46.35,20.87 v47.49,20.87 48.2,20.16 48.2,15.9 50.65,13.45 50.66,9.26 50.85,9.07 v50.85,9.06 | X1.31 55.54,7.94 55.25,7.66 50.97,7.64 50.88,7.56 v50.88,7.54 | IC8.41 17.77,14.37 18.76,15.36 18.76,17.39 16.62,19.53 16.62,21.46 v17.23,22.17
  Bottom 0.102: v50.88,7.54 50.86,7.71 v50.85,9.06 | v17.23,22.17 17.34,22.17 17.95,22.88 45.5,22.88 47.51,20.87 v47.49,20.87
D2  (via drill 0.25)
  Top 0.102: IC4.16 46.3,34.65 45.74,34.65 44.23,33.13 44.23,23.2 45.97,21.53 IC3.13 46.37,21.5 47.87,21.5 | X1.32 v51.87,6.67 | v51.8,9.03 51.8,9.11 50.99,9.92 50.99,13.71 48.62,16.08 48.62,20.95 v48.1,21.45 | v48.1,21.45 47.87,21.5 | 47.87,21.5 48.02,21.5 48.04,21.49 v48.1,21.45 | IC8.42 17.75,15.17 18.45,15.87 18.45,17.19 16.32,19.32 v16.32,22.17
  Bottom 0.102: v51.87,6.67 51.8,6.71 v51.8,9.03 | v16.32,22.17 17.34,23.18 45.73,23.18 47.41,21.5 47.85,21.5 v48.1,21.45
D3  (via drill 0.25)
  Top 0.102: X1.2 55.49,44.77 55.33,44.89 52.22,44.88 51.64,44.3 51.64,43 50.28,41.63 48.44,41.63 47.49,40.68 47.49,34.49 47.01,34.01 46.36,34.01 IC4.15 46.32,34.01 45.8,34.01 44.56,32.77 44.56,23.51 45.95,22.18 IC3.14 46.35,22.17 v47.51,22.17 | IC8.43 17.74,15.97 18.15,16.38 18.15,16.99 15.71,19.42 15.71,22.37 v16.42,23.18
  Bottom 0.102: v16.42,23.18 16.73,23.49 45.99,23.49 47.31,22.17 v47.51,22.17
D4  (via drill 0.25)
  Top 0.102: X1.3 55.23,43.5 55.18,43.45 52.67,43.45 50.41,41.19 48.6,41.19 47.93,40.52 47.93,34.26 47.04,33.38 46.35,33.38 IC4.14 45.74,33.38 44.87,32.51 44.85,23.85 45.87,22.83 IC3.15 46.39,22.88 v48.12,22.88 | IC8.44 16.43,16.77 15.41,17.7 v15.41,22.98
  Bottom 0.102: v15.41,22.98 15.51,23.18 16.02,23.79 46.29,23.79 47.21,22.88 v48.12,22.88
D5  (via drill 0.25)
  Top 0.102: X1.4 52.06,42.23 50.5,40.68 48.76,40.68 48.31,40.23 48.31,34.01 47.01,32.71 46.37,32.71 IC4.13 45.77,32.74 45.14,32.11 45.14,24.2 45.86,23.48 IC3.16 46.35,23.49 v47.51,23.49 | IC8.1 14.82,23.57 v14.8,23.59
  Bottom 0.102: v14.8,23.59 15.3,24.1 46.6,24.1 47.21,23.49 v47.51,23.49
D6  (via drill 0.25)
  Top 0.102: X1.5 51.33,40.96 50.6,40.23 49.01,40.23 48.66,39.88 48.66,33.85 46.85,32.04 46.38,32.04 IC4.12 45.8,32.07 45.42,31.69 45.42,24.49 45.78,24.13 IC3.17 46.37,24.1 v48.12,24.1 | IC8.2 14.02,24.03 v14.08,24.1
  Bottom 0.102: v14.08,24.1 14.39,24.4 46.9,24.4 47.21,24.1 v48.12,24.1
D7  (via drill 0.25)
  Top 0.102: IC3.18 47.47,24.78 | X1.6 49.26,39.69 49.07,39.5 49.07,33.57 46.95,31.44 IC4.11 48.04,31.43 49.48,30 49.51,29.89 49.51,26.82 47.51,24.71 47.47,24.78 | IC8.3 13.22,24.66 v13.17,24.71 | v47.51,24.78 47.47,24.78
  Bottom 0.102: v13.17,24.71 47.44,24.71 v47.51,24.78
D8
  Top 0.102: X1.64 55.58,8.58 55.07,8.08 50.34,8.07 49.84,8.58 49.84,13.06 48.44,14.45 IC2.18
D9
  Top 0.102: X1.65 51.55,7.31 51.14,6.9 50.59,6.9 49.49,8.01 49.49,12.77 48.47,13.79 46.33,13.79 IC2.17
D10
  Top 0.102: X1.66 50.63,6.04 49.1,7.56 49.1,12.48 48.44,13.15 IC2.16
D11  (via drill 0.25)
  Top 0.102: IC2.15 48.11,12.51 v48.12,12.52 | v51.68,12.41 51.68,13.62 49.85,15.46 v49.85,39.03 | v53.3,42.89 56.3,42.89 X1.37
  Bottom 0.102: v48.12,12.52 51.58,12.52 v51.68,12.41 | v49.85,39.03 49.85,39.45 v53.3,42.89
D12  (via drill 0.25)
  Top 0.102: IC2.14 47.46,11.86 v47.51,11.8 | v52.29,11.8 52.29,13.53 50.15,15.67 50.15,38.42 v50.76,39.03 | v53.1,41.67 56.25,41.67 X1.38
  Bottom 0.102: v47.51,11.8 v52.29,11.8 | v50.76,39.03 50.76,39.34 v53.1,41.67
D13  (via drill 0.25)
  Top 0.102: IC2.13 48.11,11.21 v48.12,11.19 | v51.68,11.19 52.59,11.19 52.9,11.5 52.9,13.53 50.46,15.97 50.46,37.71 v51.78,39.03 | v53,40.35 56.3,40.35 X1.39
  Bottom 0.102: v48.12,11.19 v51.68,11.19 | v51.78,39.03 51.78,39.13 v53,40.35
D14  (via drill 0.25)
  Top 0.102: IC2.12 47.48,10.56 v47.51,10.59 | v52.49,10.59 53.2,11.3 53.2,13.73 50.76,16.17 50.76,37 52.79,39.03 56.3,39.03 X1.40
  Bottom 0.102: v47.51,10.59 v52.49,10.59
D15  (via drill 0.25)
  Top 0.102: IC2.11 48.05,9.91 v48.12,9.98 | v53.4,10.48 53.61,10.69 53.61,13.84 51.07,16.38 51.07,36.8 52.08,37.81 56.3,37.81 X1.41
  Bottom 0.102: v48.12,9.98 52.9,9.98 v53.4,10.48
DO0
  Top 0.102: IC4.2 IC1.29
  Top 0.15: IC1.29
DO1
  Top 0.102: IC4.3 41.01,35.98 41.48,36.46 41.48,37.41 41.14,37.76 29.14,37.76 29.01,37.63 28.05,37.63
  Top 0.15: 28.05,37.63 IC1.31
DO2
  Top 0.102: IC4.4 40.9,35.33 41.8,36.23 41.8,37.6 41.17,38.23 29.14,38.23 28.69,38.68 28.07,38.68
  Top 0.15: 28.07,38.68 IC1.33
DO3
  Top 0.102: IC4.5 40.86,34.68 42.15,35.98 42.15,37.76 41.23,38.68 29.67,38.68 28.68,39.66 28.05,39.66
  Top 0.15: 28.05,39.66 IC1.35
DO4
  Top 0.102: IC4.6 40.94,34.03 42.5,35.6 42.5,37.95 41.23,39.22 35.13,39.22 33.19,41.15 28.05,41.15
  Top 0.15: 28.05,41.15 IC1.38
DO5
  Top 0.102: IC4.7 41.02,33.38 42.85,35.22 42.85,38.11 41.23,39.73 35.17,39.73 32.75,42.14 IC1.40
  Top 0.15: IC1.40
DO6
  Top 0.102: IC4.8 40.97,32.73 43.2,34.96 43.2,38.26 41.36,40.11 35.36,40.11 32.35,43.12 28.05,43.12
  Top 0.15: 28.05,43.12 IC1.42
DO7
  Top 0.102: IC4.9 40.92,32.08 43.58,34.74 43.58,38.42 41.48,40.52 35.46,40.52 31.84,44.14 IC1.44
  Top 0.15: IC1.44
DO8  (via drill 0.25)
  Top 0.102: IC3.9 38.57,20.88 | 38.57,20.88 38.52,20.88 38.52,22.22 36.34,24.4 36.34,28.67 v31.26,33.75 | IC2.2 39.91,15.11 38.57,16.45 38.57,20.88 | v26.58,37.1 26.62,37.14 IC1.30
  Top 0.15: 28.05,37.12 IC1.30
  Bottom 0.102: v31.26,33.75 27.9,37.1 v26.58,37.1
DO9  (via drill 0.25)
  Top 0.102: IC2.3 40.82,14.47 41.21,14.86 41.21,21.13 40.83,21.51 40.55,21.51 IC3.8 39.72,21.53 36.64,24.71 36.64,28.87 32.17,33.34 32.17,33.65 v31.05,34.77 | v26.58,37.92 26.81,38.14 IC1.32
  Bottom 0.102: v31.05,34.77 27.9,37.92 v26.58,37.92
DO10  (via drill 0.25)
  Top 0.102: IC2.4 41.03,13.81 41.49,14.27 41.49,21.53 40.81,22.27 40.55,22.17 IC3.7 39.68,22.18 36.94,24.91 36.94,29.08 32.58,33.45 32.58,34.05 v31.97,34.66 | v26.48,38.73 26.78,38.73 27.19,39.13 IC1.34
  Bottom 0.102: v31.97,34.66 31.97,34.77 31.15,35.58 30.75,35.58 27.39,38.93 26.68,38.93 v26.48,38.73
DO11  (via drill 0.25)
  Top 0.102: IC2.5 40.48,13.18 41.31,13.18 41.76,13.63 41.77,21.86 40.81,22.83 40.55,22.83 IC3.6 39.54,22.83 37.25,25.11 37.25,29.28 32.88,33.65 32.88,34.66 v31.86,35.68 | v26.58,39.74 26.98,40.14 IC1.36
  Bottom 0.102: v31.86,35.68 31.56,35.99 30.95,35.99 27.19,39.74 v26.58,39.74
DO12  (via drill 0.25)
  Top 0.102: IC2.6 41.51,12.52 42.08,13.08 42.08,22.19 40.81,23.46 40.55,23.46 IC3.5 39.5,23.48 37.55,25.42 37.55,29.48 33.29,33.75 33.29,35.07 v32.78,35.58 | v26.58,41.47 26.75,41.64 IC1.39
  Bottom 0.102: v32.78,35.58 31.97,36.39 31.15,36.39 26.58,40.96 v26.58,41.47
DO13  (via drill 0.25)
  Top 0.102: IC2.7 40.48,11.88 41.67,11.88 42.37,12.58 42.38,22.55 40.81,24.12 40.55,24.12 IC3.4 39.46,24.1 37.86,25.72 37.86,29.99 v33.9,33.95 | v26.58,42.49 26.74,42.64 IC1.41
  Bottom 0.102: v33.9,33.95 33.9,35.27 v26.58,42.49
DO14  (via drill 0.25)
  Top 0.102: IC2.8 41.9,11.22 42.65,11.97 42.65,22.94 40.83,24.76 40.55,24.76 IC3.3 39.31,24.78 38.16,25.93 38.16,30.5 v34.81,33.85 | v26.58,43.61 26.62,43.64 IC1.43
  Bottom 0.102: v34.81,33.85 34.81,34.77 27.19,42.39 27.19,43.3 26.89,43.61 v26.58,43.61
DO15  (via drill 0.25)
  Top 0.102: IC2.9 41.87,10.56 42.91,11.6 42.91,23.34 40.81,25.42 40.55,25.42 IC3.2 39.27,25.43 38.47,26.23 38.47,31 34.51,34.97 v34.51,35.88 | v26.58,44.62 26.6,44.64 IC1.45
  Bottom 0.102: v34.51,35.88 27.6,42.79 27.6,43.71 26.68,44.62 v26.58,44.62
GND  (via drill 0.25, 0.5)
  Top 0.305: X1.36 54.48,44.14 v54.48,44.23 | IC1.26 27.12,35.14 v26.78,35.38 27.09,35.58 28,35.58 | IC1.46 29.41,45.14 29.43,45.13
  Top 0.406: X1.1 56.4,46.04 v54.45,46.02 | X1.36 56.71,44.14 | X1.34 56.38,4.13 v54.76,4.13
  other vias: 52.29,47.47 44.32,2.74 45.48,47.16 46.19,41.47 38.98,34.16 52.49,24.5 49.03,25.11 43.55,39.85 32.88,39.64 39.69,27.45 27.6,33.45 37.15,21.25 37.96,15.16 43.85,16.48 52.18,19.02 44.26,9.87 44.46,6.52 25.87,6.62 20.99,8.25 18.66,12.92 13.68,16.48 19.06,38.73 30.54,26.84 35.22,26.94 16.52,27.35 8.09,31.52 4.53,18.31 23.33,27.04 24.35,25.42 23.33,21.76 40.5,16.99 29.83,45.03 11.14,10.59 13.07,11.4 10.63,39.54 8.9,47.97 20.18,47.67 33.08,47.87 40.91,27.45 48.83,27.45 49.24,17.7 35.79,3.14 35.89,6.6 26.04,3.14 14.66,3.35 17.3,7 7.75,3.75 4.29,6.39 11.75,27.35 15.1,33.14 52.29,32.73 28.41,15.46
  pour Top (isolate 0.254): -0.82,49.94 60.06,49.85 60.06,-0.41 -0.91,-0.25
  pour Bottom (isolate 0.254): -0.91,49.75 60.06,49.96 60.06,-0.32 -0.91,-0.53
L_OE
  Top 0.102: IC6.15 22.8,20.27 25.29,22.76 25.29,28.73 26.04,29.48 26.04,35.65 26.53,36.14 IC1.28
  Top 0.15: IC1.28
L_WE  (via drill 0.25)
  Top 0.102: IC6.14 21.72,20.92 20.47,22.17 20.47,36.63 20.21,36.9 v20.16,36.9 20.47,37 20.47,39.22 18.54,41.15 8.8,41.15 | IC4.1 35.81,37.28 v35.62,37.2 | v35.62,34.77 38.77,31.62 38.77,26.74 39.44,26.08 IC3.1 40.55,26.03 41.21,26.03 43.14,24.1 43.14,22.07 v43.45,21.76 | IC2.1 39.18,17.05 v39.18,20.24
  Top 0.15: 8.8,41.15 IC1.11
  Bottom 0.102: v35.62,37.2 v35.62,34.77 35.62,33.55 35.12,33.04 31.05,33.04 27.6,36.49 20.57,36.49 v20.16,36.9 | v39.18,20.24 40.7,21.76 v43.45,21.76
LA1
  Top 0.102: IC6.16 22.72,19.62 25.54,22.44 25.54,28.5 26.49,29.46 26.49,34.41 26.73,34.65 IC1.25
  Top 0.15: IC1.25
LA2
  Top 0.102: IC5.17 21.7,9.7 19.62,11.78 19.62,17.44 17.81,19.25 17.81,32.61 15.77,34.65 IC1.24
  Top 0.15: IC1.24
LA3
  Top 0.102: IC1.23 16.07,35.14 18.09,33.12 18.09,19.4 19.89,17.61 19.89,12.1 21.65,10.36 IC5.16
  Top 0.15: IC5.16
LA4
  Top 0.102: IC5.15 21.58,11 20.14,12.43 20.14,17.72 18.39,19.48 18.39,33.39 16.15,35.63 8.8,35.63
  Top 0.15: 8.8,35.63 IC1.22
LA5
  Top 0.102: IC5.14 21.53,11.65 20.42,12.76 20.42,17.89 18.66,19.64 18.66,33.85 16.38,36.14 IC1.21
  Top 0.15: IC1.21
LA6
  Top 0.102: IC5.13 21.45,12.3 20.7,13.08 20.7,18.01 18.97,19.71 18.97,34.18 16.5,36.65 IC1.20
  Top 0.15: IC1.20
LA7
  Top 0.102: IC5.12 21.53,12.95 20.97,13.51 20.97,18.19 19.28,19.88 19.28,34.65 16.79,37.12 8.8,37.12
  Top 0.15: 8.8,37.12 IC1.19
LA8
  Top 0.102: 21.74,13.6 21.22,14.12 21.22,18.39 19.56,20.03 19.57,35.11 17.04,37.63 8.8,37.63
  Top 0.15: IC5.11 21.74,13.6 | 8.8,37.63 IC1.18
LA9
  Top 0.102: IC6.11 21.68,22.87 21.33,23.22 21.33,40.33 19.04,42.61 8.81,42.61
  Top 0.15: 8.81,42.61 IC1.8
LA10
  Top 0.102: IC7.11 22.16,40.26 19.3,43.12 8.8,43.12
  Top 0.15: 8.8,43.12 IC1.7
LA11
  Top 0.102: 22.72,31.27 22.97,31.53 22.97,39.99 19.33,43.63 IC1.6
  Top 0.15: IC7.12 22.72,31.27 | IC1.6
LA12
  Top 0.102: 22.7,30.62 23.29,31.2 23.29,40.21 19.33,44.17 8.81,44.17
  Top 0.15: IC7.13 22.7,30.62 | 8.81,44.17 IC1.5
LA13
  Top 0.102: 22.69,29.97 23.6,30.88 23.6,40.44 19.39,44.65 IC1.4
  Top 0.15: IC7.14 22.69,29.97 | IC1.4
LA14
  Top 0.102: 22.7,29.32 23.95,30.56 23.95,40.63 19.43,45.15 8.8,45.15
  Top 0.15: IC7.15 22.7,29.32 | 8.8,45.15 IC1.3
LA15
  Top 0.102: 22.69,28.67 24.26,30.24 24.26,40.89 19.49,45.66 8.8,45.66
  Top 0.15: IC7.16 22.69,28.67 | 8.8,45.66 IC1.2
LA16
  Top 0.102: 22.7,28.02 24.61,29.92 24.61,41.05 19.52,46.14 IC1.1
  Top 0.15: IC7.17 22.7,28.02 | IC1.1
LA17
  Top 0.102: 22.63,27.37 24.96,29.7 24.96,44.78 26.31,46.14 IC1.48
  Top 0.15: IC7.18 22.63,27.37 | IC1.48
LA18
  Top 0.102: IC6.18 21.72,18.35 19.86,20.2 19.86,35.46 17.22,38.11 8.82,38.11
  Top 0.15: 8.82,38.11 IC1.17
LA19
  Top 0.102: IC6.17 21.66,18.97 20.16,20.47 20.16,35.92 17.39,38.68 8.82,38.68
  Top 0.15: 8.82,38.68 IC1.16
LA20
  Top 0.102: IC6.12 21.6,22.22 21.09,22.74 21.09,40 18.95,42.14 IC1.9
  Top 0.15: IC1.9
LA21
  Top 0.102: IC6.13 21.64,21.57 20.78,22.43 20.78,39.64 18.79,41.63 IC1.10
  Top 0.15: IC1.10
N$1  (via drill 0.25)
  Top 0.102: IC8.24 7.62,8.59
  Top 0.15: 7.62,8.59 v7.65,8.61
  Bottom 0.102: 7.65,8.67 5.84,10.48 5.84,32.06 SV1.2
  Bottom 0.15: v7.65,8.61 7.65,8.67
N$2
  Top 0.102: SV1.3 4.57,36.39 5.93,35.03 5.93,20.8 6.85,19.88 6.85,18.8
  Top 0.15: 6.85,18.8 IC8.11
N$3
  Top 0.102: SV1.4 4.31,38.93 6.31,36.93 6.31,21.31 7.61,20.01 7.61,18.78
  Top 0.15: 7.61,18.78 IC8.10
N$4
  Top 0.102: SV1.5 4.66,41.47 6.69,39.44 6.69,21.72 8.41,20.01 8.41,18.78
  Top 0.15: 8.41,18.78 IC8.9
N$8
  Top 0.102: 5.07,24.1 5.07,22.15 3.33,20.4 3.33,15.69 3.84,15.18 4.81,15.18
  Top 0.15: SW1.2 4.04,25.14 5.07,24.1 | 4.81,15.18 IC8.14
OE  (via drill 0.25)
  Top 0.102: X1.9 53.05,35.88 51.4,34.24 51.4,22.22 v51.7,22.03 | v30.06,19.6 28.02,19.6 | IC8.16 6.06,13.57 v7.56,12.08 | v8.35,13.51 8.35,14.97 v9.01,15.63
  Top 0.15: 28.02,19.6 IC6.5
  Bottom 0.102: v51.7,22.03 50.01,22.05 47.56,19.6 v30.06,19.6 30.03,19.63 25.14,19.63 24.47,19.06 17.01,19.06 | v7.56,12.08 8.37,12.72 v8.35,13.51 | v9.01,15.63 9,17.46 10.62,19.08
  Bottom 0.15: 10.62,19.08 16.11,19.08 17.01,19.06
OE_EVEN  (via drill 0.25)
  Top 0.102: IC4.19 v44.89,36.63 v44.88,36.65 | v10,8.42 10,6.8
  Top 0.15: 10,6.8 IC8.27
  Bottom 0.102: v44.88,36.65 44.86,36.65 40.88,32.67 29.06,32.67 27.8,31.41 9.86,31.41 7.34,28.89 7.33,15.39 9.98,12.74 v10,8.42
OE_ODD
  Top 0.102: IC2.19 44.74,15.11 43.8,14.17 43.8,11.51 36.78,4.48 12.44,4.48 9.74,1.78 7.49,1.78 5.77,3.5 5.77,7.21 4.85,8.13 4.85,8.74
  Top 0.15: 4.85,8.74 IC8.22
OE_ODD_LOW  (via drill 0.25)
  Top 0.102: IC8.23 6.82,2.99 7.55,2.26 9.65,2.26 12.28,4.9 36.65,4.9 43.18,11.45 43.18,20.73 44.06,21.46 44.06,21.96 43.35,22.68 43.35,25.01 v42.94,25.42 | v47.49,25.79 47.11,25.41 46.36,25.41 IC3.19
  Bottom 0.102: v42.94,25.42 47.12,25.42 v47.49,25.79
REG#  (via drill 0.25)
  Top 0.102: X1.61 54.62,12.39 53.99,11.79 53.99,9.4 v53.72,9.06 | v15.04,11.15 16.8,11.15
  Top 0.15: 16.8,11.15 IC8.37
  Bottom 0.102: v53.72,9.06 53.72,5.56 53.05,4.9 18.09,4.9 14.73,8.26 14.73,10.83 v15.04,11.15
WE  (via drill 0.25)
  Top 0.102: v33.17,28.03 33.16,24.13 33.16,24.17 29.22,20.23 28.03,20.23 | X1.15 54.69,28.26 v54.67,28.24
  Top 0.15: 28.03,20.23 IC6.6
  Bottom 0.102: v54.67,28.24 53.83,28.24 53.2,28.87 35.93,28.87 35.32,28.26 33.4,28.26 v33.17,28.03

### Text on the board
tNames: SAKURA | v2.0 | 4MB SRAM by strim_ & jarob